# Altium project Desafio.PrjPcb
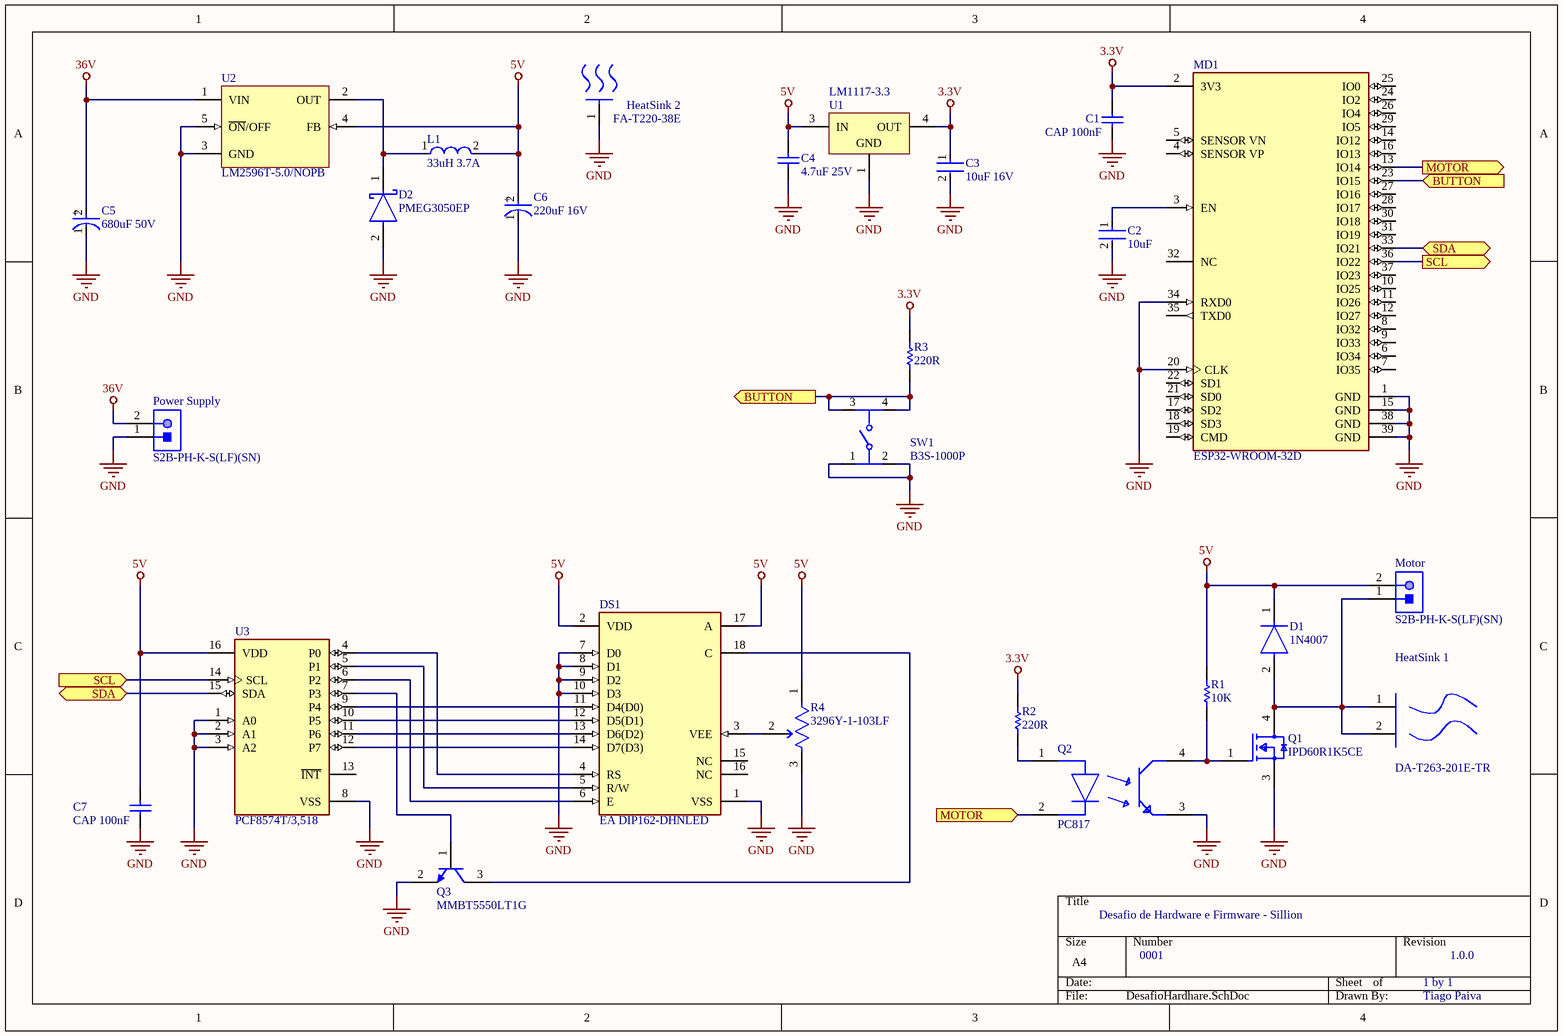
[diagram p0: DesafioHardhare.SchDoc]
1 sheet, 27 parts. Net scope: flat (ports and power ports of the same name join across sheets).
Board file: DesafioHardware.PcbDoc

## Sheet DesafioHardhare.SchDoc
size A4; SheetNumber: 1; SheetTotal: 1

### Parts
C1  CAP 100nF  [CAPC1210(3225)170_M]
C2  10uF  [FP-GRM188-0_1-e0_2_0_55-IPC_A]
C3  10uF 16V  [FP-GRM21B-0_1-IPC_C]
C4  4.7uF 25V  [CAPC1210(3225)220_M]
C5  680uF 50V  [FP-RAD-TH-D_12_5_0_5-L_30-MFG]
C6  220uF 16V  [FP-FKD8-MFG]
C7  CAP 100nF  [CAPC1210(3225)170_M]
D1  1N4007  [FP-1N4007-MFG]
D2  PMEG3050EP  [FP-SOD128-MFG]
DS1  EA DIP162-DHNLED  [FP-EA_DIP162-DHNLED-MFG]
HeatSink_1  DA-T263-201E-TR  [FP-DA-T263-201E-TR-MFG]
HeatSink_2  FA-T220-38E  [FP-FA-T220-38E-MFG]
L1  33uH 3.7A  [FP-IHLP-4040DZ-FP_3_124x3-MFG]
MD1  ESP32-WROOM-32D  [FP-ESP32-WROOM-32D-MFG]
Motor  S2B-PH-K-S(LF)(SN)  [JST-S2B-PH-K-S_V]
Power_Supply  S2B-PH-K-S(LF)(SN)  [JST-S2B-PH-K-S_V]
Q1  IPD60R1K5CE  [FP-PG-TO252-3-MFG]
Q2  PC817  [FP-PC817X4NIP0F-MFG]
Q3  MMBT5550LT1G  [ONSC-SOT-23-3-318-08_V]
R1  10K  [RESC3216X70X50LL05T20]
R2  220R  [RESC3216X70X50LL05T20]
R3  220R  [RESC3216X70X50LL05T20]
R4  3296Y-1-103LF  [FP-3296Y-MFG]
SW1  B3S-1000P  [FP-B3S-1000P-MFG]
U1  LM1117-3.3  [NDP0003B_M]
U2  LM2596T-5.0/NOPB  [NDH0005A]
U3  PCF8574T/3,518  [FP-SOT162-1-MFG]

### Ports
BUTTON (in, see DesafioHardhare[2B]), BUTTON (out, see DesafioHardhare[4A]), MOTOR (in, see DesafioHardhare[4A]), MOTOR (out, see DesafioHardhare[3D]), SCL (in, see DesafioHardhare[4B]), SCL (out, see DesafioHardhare[1C]), SDA (bidir, see DesafioHardhare[1C]), SDA (bidir, see DesafioHardhare[4A])

### Nets
3.3V: C1.2 C3.1 MD1.2(3V3) R2.2 R3.2 U1.4(OUT)
5V: C4.1 C6.2(A) C7.2 D1.1(C) DS1.2(VDD) DS1.17(A) L1.2 Motor.2 R1.2 R4.1(CCW) U1.3(IN) U2.4(FB) U3.16(VDD)
36V: C5.2(A) Power_Supply.2 U2.1(VIN)
GND: C1.1 C2.2 C3.2 C4.2 C5.1(C) C6.1(C) C7.1 D2.2(A) DS1.1(VSS) DS1.7(D0) DS1.8(D1) DS1.9(D2) DS1.10(D3) HeatSink_2.1(MNT_1) MD1.1(GND) MD1.15(GND) MD1.20(CLK) MD1.34(RXD0) MD1.38(GND) MD1.39(GND) Power_Supply.1 Q1.3(SOURCE) Q2.3(E) Q3.2(E) R4.3(CW) SW1.1 SW1.2 U1.1(GND) U2.3(GND) U2.5(~{ON}/OFF) U3.1(A0) U3.2(A1) U3.3(A2) U3.8(VSS)
NetC2_1: C2.1 MD1.3(EN)
NetD1_2: D1.2(A) HeatSink_1.1(MNT_1) HeatSink_1.2(MNT_2) Motor.1 Q1.4(DRAIN)
NetD2_1: D2.1(C) L1.1 U2.2(OUT)
NetDS1_3: DS1.3(VEE) R4.2(WIPER)
NetDS1_4: DS1.4(RS) U3.4(P0)
NetDS1_5: DS1.5(R/W) U3.5(P1)
NetDS1_6: DS1.6(E) U3.6(P2)
NetDS1_11: DS1.11(D4(D0)) U3.9(P4)
NetDS1_12: DS1.12(D5(D1)) U3.10(P5)
NetDS1_13: DS1.13(D6(D2)) U3.11(P6)
NetDS1_14: DS1.14(D7(D3)) U3.12(P7)
NetDS1_18: DS1.18(C) Q3.3(C)
NetMD1_13: MD1.13(IO14) Q2.2(C) ; port MOTOR
NetMD1_23: MD1.23(IO15) R3.1 SW1.3 SW1.4 ; port BUTTON
NetMD1_33: MD1.33(IO21) U3.15(SDA) ; port SDA
NetMD1_36: MD1.36(IO22) U3.14(SCL) ; port SCL
NetQ1_1: Q1.1(GATE) Q2.4(C) R1.1
NetQ2_1: Q2.1(A) R2.1
NetQ3_1: Q3.1(B) U3.7(P3)

Not connected (* = marked no-connect by the designer): DS1 15(NC) 16(NC); MD1 4(SENSOR_VP) 5(SENSOR_VN) 6(IO34) 7(IO35) 8(IO32) 9(IO33) 10(IO25) 11(IO26) 12(IO27) 14(IO12) 16(IO13) 17(SD2) 18(SD3) 19(CMD) 21(SD0) 22(SD1) 24(IO2) 25(IO0) 26(IO4) 27(IO16) 28(IO17) 29(IO5) 30(IO18) 31(IO19) 32(NC) 35(TXD0) 37(IO23); U3 13(~{INT})

### Notes on the sheet
- Desafio de Hardware e Firmware - Sillion
- 0001
- 1 by 1
- 1.0.0
- Tiago Paiva
- (in symbol CMP-05427-000071-1) +
- (in symbol CMP-05427-000465-1) +

### Library data of the parts
C1 C7 = CMP-1038-01664-1: CAP 100nF 100V ±5% 1210 (3225 Metric) Thickness 1.7mm SMD; Case-Metric: 3225; Tolerance: Â±5%; Case-EIA: 1210; Rated Voltage: 100 V; Max Thickness: 1.7 mm; Value: 100nF; Technology: SMT
C2 = CMP-2006-02792-2: Chip Multilayer Ceramic Capacitors for General Purpose, 0603, 10uF, X5R, 15%, 20%, 6.3V; Packaging: Tape and Reel; Voltage Rating (DC): 6.3V; Width: 0.031inch; Termination: SMD/SMT; Dielectric: X5R; Package Quantity: 4000; Voltage Rating: 6.3V; Capacitance: 10uF; Case/Package: 0603; Min Operating Temperature: -55°C; Voltage: 6.3V; Length: 1.6mm; Thickness: 0.035inch; Lead Free: Lead Free; Depth: 0.8mm; Case Code (Imperial): 0603; Max Operating Temperature: 85°C; Material: Ceramic; Height: 0.8mm; Tolerance: 20%; Mount: Surface Mount; REACH SVHC: No SVHC; Radiation Hardening: No; Case Code (Metric): 1608
C3 = CMP-2007-03453-2: Chip Multilayer Ceramic Capacitors for General Purpose, 0805, 10uF, X5R, 15%, 10%, 16V; Radiation Hardening: No; Thickness: 0.053inch; Voltage Rating (DC): 16V; Lead Free: Lead Free; Package Quantity: 1; Width: 1.25mm; Case Code (Imperial): 0805; Depth: 1.25mm; Packaging: Tape and Reel; Dielectric: X5R; Max Operating Temperature: 85°C; Tolerance: 10%; Voltage Rating: 16V; Voltage: 16V; Capacitance: 10uF; Height: 1.25mm; Case Code (Metric): 2012; Material: Ceramic; Mount: Surface Mount; Case/Package: 0805; REACH SVHC: No SVHC; Length: 2mm; Min Operating Temperature: -55°C; Termination: SMD/SMT
C4 = CMP-1038-02151-2: CAP 4.7uF 25V ±10% 1210 (3225 Metric) Thickness 2.2mm SMD; Case-Metric: 3225; Case-EIA: 1210; Tolerance: Â±10%; Value: 4.7uF; Technology: SMT; Max Thickness: 2.2 mm; Rated Voltage: 25 V
C5 = CMP-05427-000465-1: Aluminum Electrolytic Capacitors (Radial Lead Type) 680uF ±20% 50V
C6 = CMP-05427-000071-1: CAP ALUM 220UF 20% 16V SMD; Life (Hours): 2000Hour; Ripple Current (AC): 280mA; Leakage Current: 3uA; Polarity: Polar; Material: Aluminium; Impedance: 340mR; Voltage Rating: 16V; Length: 7.7mm; Voltage: 16V; Termination: SMD/SMT; Voltage Rating (DC): 16V; Radiation Hardening: No; Number of Pins: 8; Construction: Cylindrical; Min Operating Temperature: -55°C; Mount: Surface Mount; Series: FK; Height: 7.7mm; REACH SVHC: No SVHC; Tolerance: 20%; Ripple Current: 280mA; Diameter: 6.3mm; RoHS Compliant: Yes; Case/Package: Radial; Height - Seated (Max): 0.315inch; Package Quantity: 900; Packaging: Tape and Reel; Max Operating Temperature: 105°C; Lead Free: Lead Free; Contact Plating: Tin; Width: 8.3mm; Capacitance: 220uF; ESR (Equivalent Series Resistance): 340mR
D1 = CMP-123542-000001-1: Rectifier diode 1000 V 1 A DO-41, ,; Manufacturer: Diotec; Max Surge Forward Current: 27A; Forward Current: 1A; Max Junction Temp: +175°C; Reverse Voltage: 1000V; Value: 15pF; Peak Reverse Current: 5uA; Category: Diode; Temperature Range Low: -50°C; Automotive: No; Temperature: -50°C to +175°C; Lead Free: Yes; ComponentLink2Description: Datasheet; Max Repetitive Reverse Voltage: 1000V; ComponentLink2URL: https://datasheet.octopart.com/1N4007-Diotec-datasheet-62346875.pdf; Manufacturer Part Number: 1N4007; Device Class L3: Rectifier Diodes; Height: 2.8mm; Octopart: https://octopart.com/1n4007-diotec-4040411; Package: 1N4007; Temperature Range High: +175°C; Device Class L1: Discrete Semiconductors; Device Class L2: Diodes; RoHS: TRUE; Capacitance: 15pF; Ipc Land Pattern Name: DIOAD888W100L520D280
D2 = CMP-14398-000051-1: DIODE SCHOTTKY 30V 5A SOD128; RoHS Compliant: Yes
DS1 = CMP-140401-000001-1: LCD MOD CHAR 2X16 Y/G BACKLIT; Manufacturer: Display Visions; Number Of Characters: 32; Min Supply Voltage: 2.7V; Max Supply Voltage: 5V; Interface: Parallel; Colour: Yellow/Green; Temperature Range High: +70°C; Device Class L2: Displays; Height: 11mm; Device Class L3: LCD; Display Type: LCD; Package: EA DIP162-DHNLED; Lead Free: Yes; Digikey Description: LCD MOD CHAR 2X16 Y/G BACKLIT; RoHS: TRUE; Device Class L1: Optoelectronics; Automotive: No; Manufacturer Part Number: EA DIP162-DHNLED; ComponentLink2Description: Datasheet; Octopart: https://octopart.com/ea+dip162-dhnled-display+visions-99339882; Temperature Range Low: -20°C; Category: Disp; Temperature: -20°C to +70°C; ComponentLink2URL: https://www.lcd-module.de/fileadmin/eng/pdf/doma/dip162-de.pdf
HeatSink_1 = CMP-33535-000006-1: HEATSINK FOR TO-263; Shape: Fins; Thermal Resistance @ Forced Air Flow (100 LFM): 8°C/W; Width: 12.7mm; Package Cooled: TO-263; Length: 25.9mm; Height: 12.1mm; Package Quantity: 200; Packaging: Tape and Reel; Case/Package: TO-252; Type: Passive; Material: Aluminium; Natural Thermal Resistance: 8°C/W; Mount: Solderable Feet; Height Off Base: 0.48inch; Color: Black
HeatSink_2 = CMP-33535-000020-1: HEATSINK TO-218,TO-220,TO-247; Natural Thermal Resistance: 3.8°C/W; Shape: Fins; Thermal Resistance @ Forced Air Flow (100 LFM): 1.5°C/W; Finish: Anodized; Width: 25mm; Length: 41.6mm; Material: Aluminium; Case/Package: TO-220; Height: 38.1mm; Packaging: Bulk; Height Off Base: 0.984inch; Series: F; Mount: Bolt; Weight: 27g; RoHS Compliant: Yes; Type: Passive; Package Cooled: TO-220; Color: Black; Package Quantity: 10
L1 = CMP-02424-000211-1: Automotive Inductors, High Temperature (155 °C) Series 33uH 3.7A 117.7mΩ 20%; Test Frequency: 100kHz; DC Resistance (DCR): 117.7mR; Saturation Current: 4.2A; Shielding: Shielded; Lead Free: Lead Free; Width: 0.405inch; Package Quantity: 500; Current Rating: 3.7A; Tolerance: 20%; Min Operating Temperature: -55°C; Packaging: Tape and Reel; Max Operating Temperature: 125°C; Inductance: 33uH; Military Standard: Not; Case/Package: 4040; Depth: 10.3mm; Length: 0.425inch; Max DC Current: 4.2A; Height: 4mm; Termination: SMD/SMT; Mount: Surface Mount; Height - Seated (Max): 0.158inch
MD1 = CMP-194065-000003-1: WIFI MODULE 32MBITS SPI FLASH; Manufacturer: Espressif Systems; Max Supply Voltage: 3.6V; Nominal Supply Current: 500mA; Max Frequency: 2484MHz; Number Of Adc Channels: 16; Number Of Gpio: 32; Interface: I2C,SPI,UART,Ethernet,I2S,Other; Data Rate: 150Mbits/s; Min Supply Voltage: 3V; Bandwidth: 72MHz; Sensitivity: -98dBm; Octopart: https://octopart.com/esp32-wroom-32d-espressif+systems-91040050; Package: ESP32-WROOM-32D; ComponentLink2URL: https://www.espressif.com/sites/default/files/documentation/esp32-wroom-32d_esp32-wroom-32u_datasheet_en.pdf; Lead Free: Yes; Category: UNK; Mouser Description: Wi-Fi/BT BLE Module ESP32-D0WD, SPI Flash, UART, P; Device Class L1: Integrated Circuits (ICs); RoHS: TRUE; Temperature Range Low: -40°C; ComponentLink2Description: Datasheet; Digikey Description: WIFI MODULE 32MBITS SPI FLASH; Height: 3.2mm; Temperature: -40°C to +85°C; Manufacturer Part Number: ESP32-WROOM-32D; Device Class L3: Transceivers; Device Class L2: RF Semiconductors and Devices; Temperature Range High: +85°C; Automotive: No
Motor Power_Supply = CMP-1755-00004-1: Male Header, Pitch 2 mm, 1 x 2 Position, Height 4.8 mm, Tail Length 3.4 mm, -25 to 85 degC, RoHS, Bulk; Case\Package: Radial; Tolerance: 20%; Capacitance: 10 uF; Voltage Rating (DC): 50 V; Packaging: Bulk; ComponentLink1URL: http://www.jst-mfg.com/product/pdf/eng/ePH.pdf; Radiation Hardening: No; Height: 11 mm; Package Quantity: 200; PackageDescription: Male Header, Pitch 2 mm, 1 x 2 Position, Height 4.8 mm, Tail Length 3.4 mm; PackageReference: S2B-PH-K-S; Diameter: 5 mm; Pins: 2; Mount: Through Hole; Max Operating Temperature: 85 degC; Min Operating Temperature: -40 degC; ComponentLink1Description: Datasheet; DatasheetVersion: Dec-12; Length: 11 mm; Lead Pitch: 2 mm; REACH SVHC: No SVHC; Voltage Rating: 50 V; RoHSCompliant: true
Q1 = CMP-32901-001299-1: MOSFET N-CH 650V 5A TO252; Max Dual Supply Voltage: 600V; RoHS Compliant: Yes; Mount: Surface Mount; Lead Free: Contains Lead; Halogen Free: Halogen Free; Min Operating Temperature: -40°C; Max Operating Temperature: 150°C; Drain to Source Voltage (Vdss): 600V
Q2 = CMP-65434-000001-1: OPTOISOLATOR 5KV TRANS 4SMD; Manufacturer: Sharp; Manufacturer Part Number: PC817X4NIP0F; Collector Emitter Voltage: 80V; Standoff Height: 0.1mm; Power Dissipation: 200mW; Min Current Transfer Ratio: 50%; Reverse Voltage: 6V; Forward Current: 20mA; Forward Voltage: 1.2V; Max Current Transfer Ratio: 600%; Isolation Voltage: 5kVrms; Mouser Description: Transistor Output Optocouplers Photocoupler 300-600% CRT; RoHS: TRUE; ComponentLink2URL: https://www.sharpsde.com/fileadmin/products/Optoelectronics/Isolation%20Devices/Specs%20Photocoupler/PC817XxNIP0F_17Jun08_Spec_ED-04P129A.pdf; Lead Free: Yes; Device Class L1: Optoelectronics; ComponentLink2Description: Datasheet; Device Class L2: Optocouplers; Temperature: -30°C to +100°C; Temperature Range Low: -30°C; Automotive: No; Temperature Range High: +100°C; Octopart: https://octopart.com/pc817x4nip0f-sharp-20650453; Height: 4.6mm; Digikey Description: OPTOISOLATOR 5KV TRANS 4SMD; Category: Trans; Device Class L3: unset; Package: PC817X4NIP0F; Emiiter Collector Voltage: 6V
Q3 = CMP-1048-00659-1: High Voltage Transistor, NPN Silicon, 3-Pin SOT-23, Pb-Free, Tape and Reel; Manufacturer: On Semiconductor; IC Continuous (A): 0.6; PackageDescription: 3-Pin Small Outline Transistor, Body 2.92 x 1.3 mm, Pitch 0.95 mm; ComponentLink3URL: http://www.onsemi.cn/pub_link/Collateral/318-08.PDF; RoHS: TRUE; ComponentLink2URL: http://www.onsemi.cn/pub_link/Collateral/MMBT5550LT1-D.PDF; DatasheetVersion: Rev. 10; ComponentLink1URL: http://www.onsemi.com/; PackageReference: SOT-23-3-318-08; PackageVersion: Rev. AP, 11/2009; Mounting Technology: Surface Mount; ComponentLink2Description: Datasheet; PartNumber: MMBT5550LT1G; ComponentLink3Description: Package Specification; Packing: Tape and Reel; Polarity: NPN; ComponentLink1Description: Manufacturer URL
R1-R3 = CMP-2003-00388-1: Manufacturer: Panasonic; Part Number: ERJ8ENF4700V
R4 = CMP-07234-000015-2: TRIMMER 10K OHM 0.5W PC PIN TOP; Manufacturer Series: 3296; Resistance: 10kR; Actuator Orientation: Vertical; Power Rating: 500mW; Temperature Coefficient: 100ppm/°C; Resistance Tolerance: 10%; Resistance Law: Linear; Number of Turns: 25; Actuator Type: SCREW; Number of Terminals/Pins: 3; Insulation Resistance: 1GR; Military Standard: Not; REACH SVHC: No SVHC; Lead Free: Lead Free; Resistor Type: Cermet; Max Operating Temperature: 125°C; Radiation Hardening: No; Package Quantity: 50; Mount: Panel; Max Power Dissipation: 500mW; Min Operating Temperature: -55°C; Type: Potentiometer; Terminal Finish: Tin; Termination: Pin; Taper: Linear; Color: Blue; Technology: CERMET; Packaging: Rail/Tube; Weight: 0.03oz; Height: 0.395inch; Number of Pins: 3; RoHS Compliant: Yes; Width: 9.53mm; Tolerance: 10%; Depth: 4.83mm; Series: 3296; Length: 9.53mm
SW1 = CMP-08834-000008-1: SWITCH TACTILE SPST-NO 0.05A 24V; Throw Configuration: SPST; Switch Function: Off-Mom; Switch Travel: 0.25mm; Contact Current Rating: 50mA; Actuator Length: 0.8mm; Mechanical Life: 500000Cycles; Contact Resistance: 100mR; Operating Force: 1.57N; Actuator Type: Standard; Illumination Type: Non-Illuminated; Ratings: IP67; Number of Poles: 1; Package Quantity: 1; Orientation: Straight; REACH SVHC: No SVHC; Lead Free: Lead Free; Max Current Rating: 50mA; Contact Plating: Silver; Current Rating: 50mA; Depth: 9mm; Contact Material: Bronze; Electrical Life: 500000Cycles; Termination: Gull Wing; Width: 6mm; Packaging: Tape and Reel; Min Operating Temperature: -25°C; Radiation Hardening: No; Max Voltage Rating (DC): 24V; Max Operating Temperature: 70°C; Length: 6.6mm; Height: 3.65mm; Voltage Rating (DC): 24V; Weight: 0.010582oz; Mount: Surface Mount
U1 = CMP-0062-00703-3: 800mA Low-Dropout Linear Regulator, 3-pin TO-252, Pb-Free; Manufacturer: Texas Instruments; PowerWise: N; PackageTopMarking: NSUZXYTT*LM1117*DT-3.3; CompType: LDO IC; RoHS: Y; PackageReference: NDP0003B; PackageDescription: TO252, Molded, Jedec, 6.8 x 6.10 x 2.30mm Body, 3 Lead, 2.28mm Pitch, Surface Mount; Code_JEDEC: TO-252-AA; PinCount: 3; ComponentLink1URL: http://www.ti.com/general/docs/lit/getliterature.tsp?genericPartNumber=LM1117-N&fileType=pdf; ComponentLink1Description: Datasheet URL
U2 = CMP-0069-01926-3: SIMPLE SWITCHER® Power Converter 150 KHz 3A Step-Down Voltage Regulator, 5-pin TO-220, Pb-Free; Manufacturer: Texas Instruments; PowerWise: N; PackageTopMarking: NSUZXYTTE#*LM2596T*-5.0 P+; ComponentLink1URL: http://www.ti.com/general/docs/lit/getliterature.tsp?genericPartNumber=LM2596&fileType=pdf; PackageDescription: TO-220, Molded, Stagger Bend, 5 Lead; ComponentLink1Description: Datasheet URL; PinCount: 5; RoHS: Y; CompType: Switcher; PackageReference: NDH0005A
U3 = CMP-10112-000010-1: IC I/O EXPANDER I2C 8B 16SOIC; Manufacturer: NXP Semiconductors; Frequency: 100kHz; Max Supply Voltage: 6V; Standoff Height: 0.1mm; Nominal Supply Current: 40uA; Max Junction Temp: +125°C; Min Supply Voltage: 2.5V; Number Of I/Os: 8; Manufacturer Part Number: PCF8574T/3,518; Footprint Url: https://www.nxp.com/docs/en/package-information/SOT162-1.pdf; ComponentLink2URL: https://www.nxp.com/docs/en/data-sheet/PCF8574_PCF8574A.pdf; Automotive: No; Digikey Description: IC I/O EXPANDER I2C 8B 16SOIC; Mouser Description: PCF8574 Series 2.5 - 6V Remote 8-bit I/O Expander for I2C-bus - SOIC-16; Ipc Land Pattern Name: SOIC127P1032X265-16; Interface: I2C; Octopart: https://octopart.com/pcf8574t%2F3%2C518-nxp+semiconductors-10470852; Ambient Temperature Range Low: -40°C; Lead Free: Yes; Device Class L2: Interface ICs; Temperature Range High: +85°C; Device Class L1: Integrated Circuits (ICs); Package: SOT162-1; ComponentLink2Description: Datasheet; Device Class L3: I/O Expanders; Temperature: -40°C to +85°C; Ambient Temperature Range High: +85°C; Height: 2.65mm; Category: IC; RoHS: TRUE; Temperature Range Low: -40°C